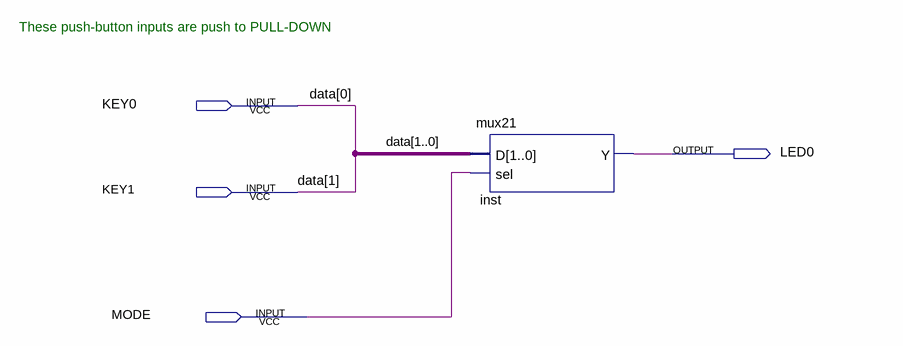
[diagram p0: schematic sheet]
// Quartus schematic comb_logic.bdf as structural Verilog: 1 symbols, 4 pins
module comb_logic (
  input  KEY0,
  input  KEY1,
  input  MODE,
  output LED0
);

  mux21 inst (.D({KEY1, KEY0}), .sel(MODE), .Y(LED0));

  // Other names for the same wires on the sheet: data[1:0] = {KEY1, KEY0}

  // Notes on the sheet:
  //   These push-button inputs are push to PULL-DOWN
endmodule
